# EAGLE design WalkerStalkerv21 (EAGLE 6.4)
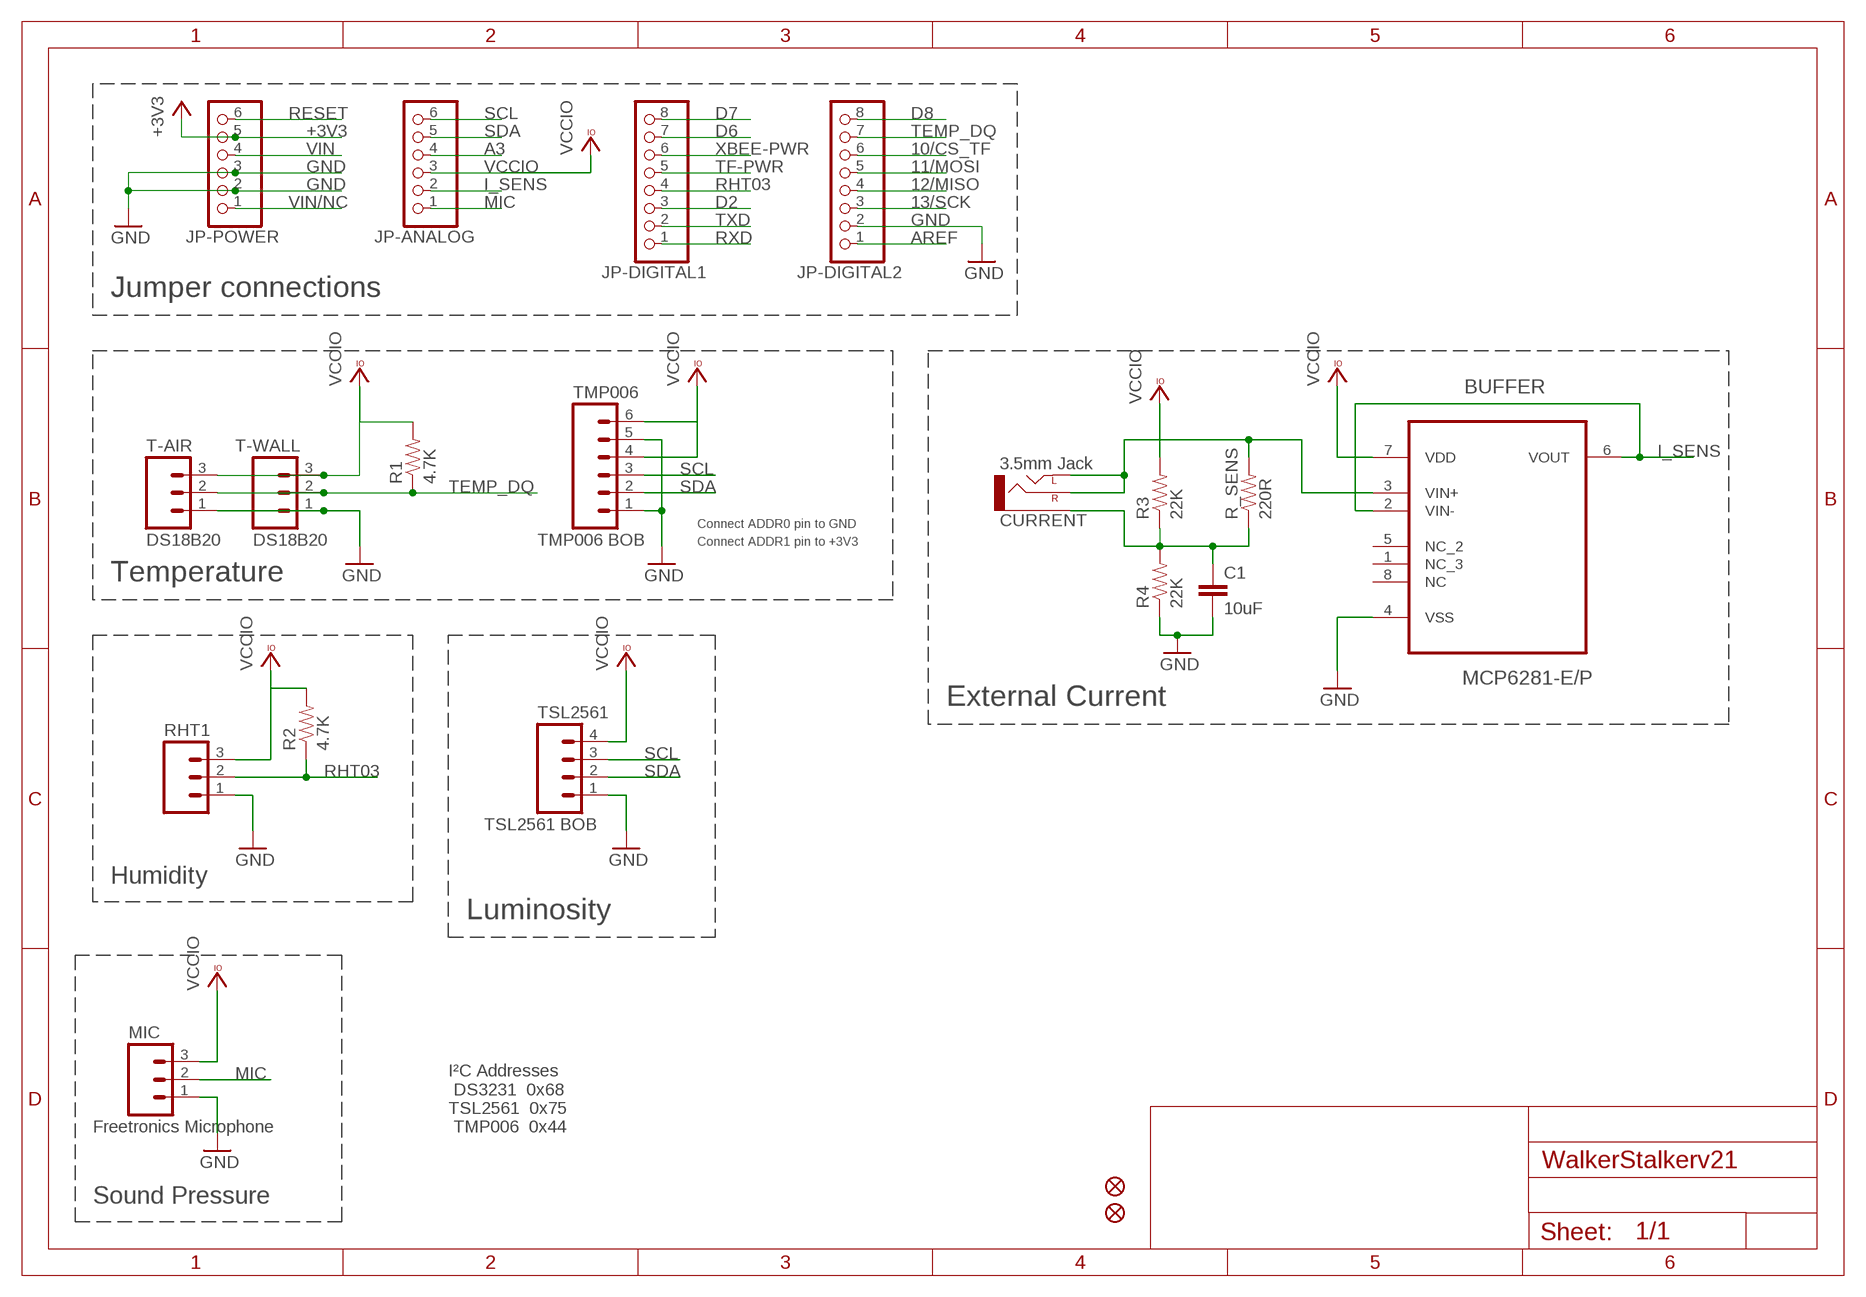
[diagram p0: schematic, sheet 1, part 1 of 2]
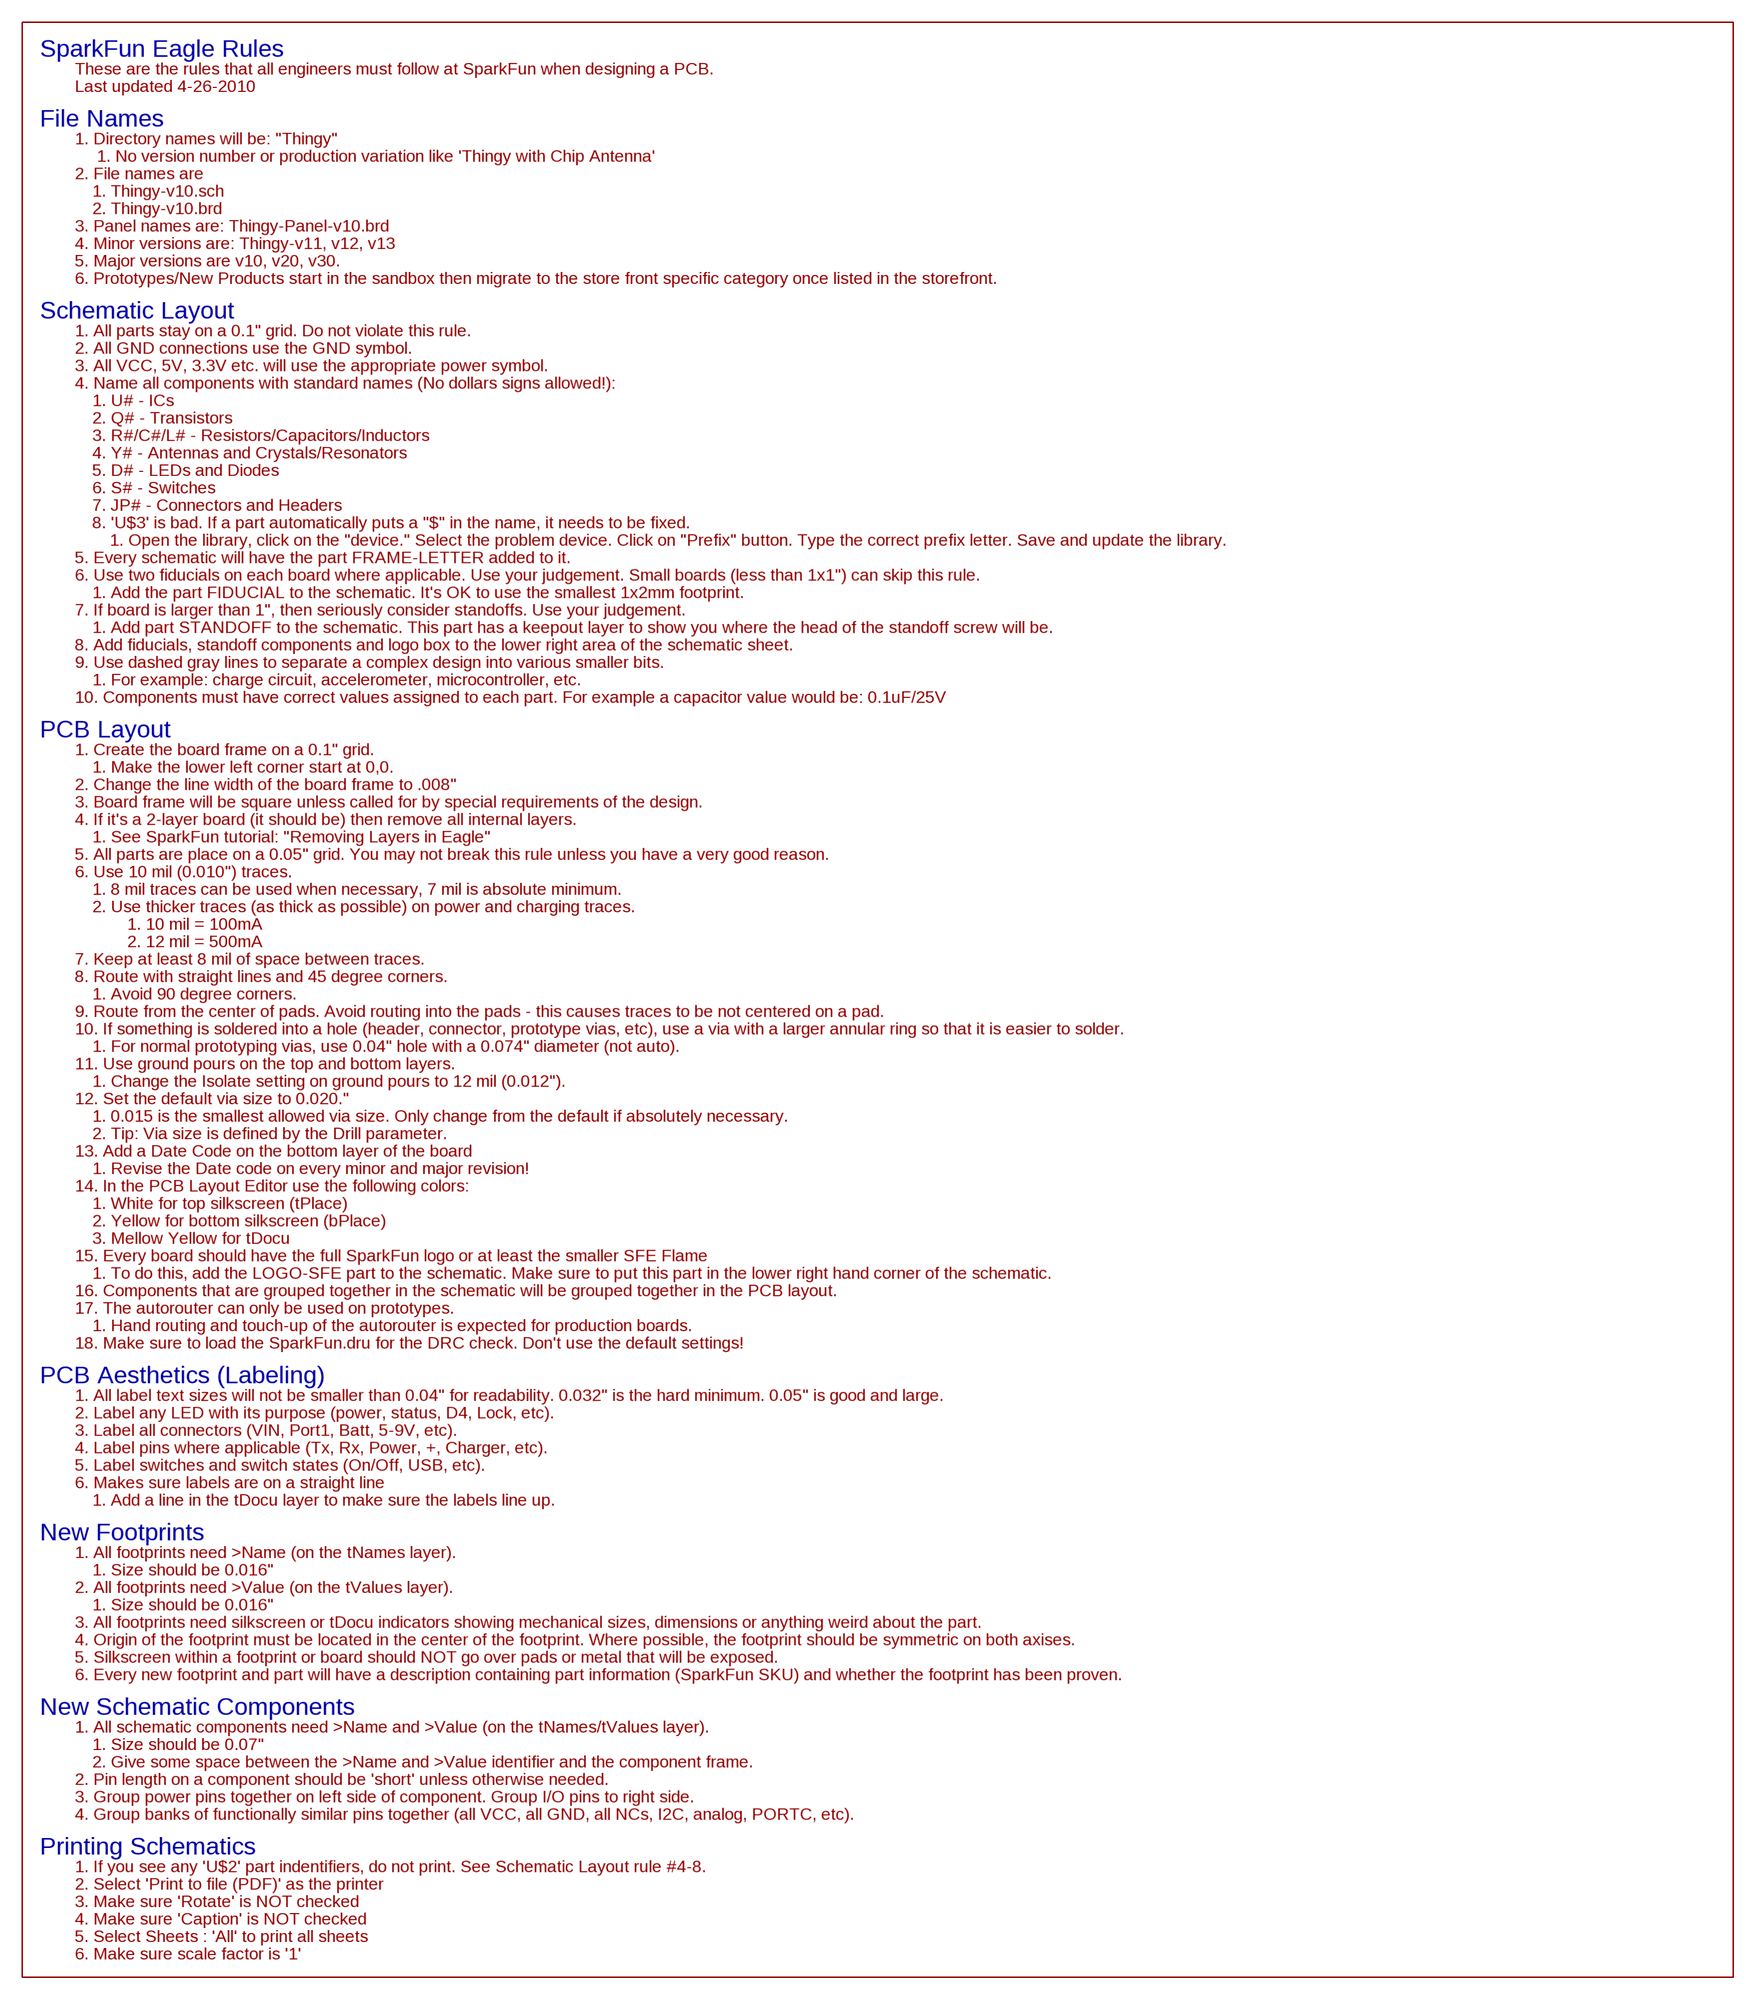
[diagram p1: schematic, sheet 1, part 2 of 2]

## Parts
BUFFER  MCP6281-E/P  [DIP254P762X432-8]
C1  10uF  CAP1206  [1206]
CURRENT  3.5mm Jack  AUDIO-JACKPTH  [AUDIO-JACK]
FID1  FIDUCIAL1.5X3  [FIDUCIAL-1.5X3]
FID2  FIDUCIAL1.5X3  [FIDUCIAL-1.5X3]
JP-ANALOG  PINHD-1X6CB  [1X06-CLEANBIG]
JP-DIGITAL1  PINHD-1X8CLEANBIG  [1X08-CLEANBIG]
JP-DIGITAL2  PINHD-1X8CLEANBIG  [1X08-CLEANBIG]
JP-POWER  PINHD-1X6CB  [1X06-CLEANBIG]
MIC  Freetronics Microphone  M03PTH  [1X03]
R1  4.7K  RESISTOR1206  [1206]
R2  4.7K  RESISTOR1206  [1206]
R3  22K  RESISTOR1206  [1206]
R4  22K  RESISTOR1206  [1206]
R_SENS  220R  RESISTOR1206  [1206]
RHT1  RHT03  M03PTH  [1X03]
T-AIR  DS18B20  M03PTH  [1X03]
T-WALL  DS18B20  M03PTH  [1X03]
TMP006  TMP006 BOB  M06SIP  [1X06]
TSL2561  TSL2561 BOB  M04PTH  [1X04]

## Nets
10/CS_TF: JP-DIGITAL2.6
11/MOSI: JP-DIGITAL2.5
12/MISO: JP-DIGITAL2.4
13/SCK: JP-DIGITAL2.3
+3V3: JP-POWER.5
A3: JP-ANALOG.4
AREF: JP-DIGITAL2.1
D2: JP-DIGITAL1.3
D6: JP-DIGITAL1.7
D7: JP-DIGITAL1.8
D8: JP-DIGITAL2.8
GND: BUFFER.4(VSS) C1.2 JP-DIGITAL2.2 JP-POWER.2 JP-POWER.3 MIC.1 R4.1 RHT1.1 T-AIR.1 T-WALL.1 TMP006.1 TMP006.5 TSL2561.1
I_SENS: BUFFER.2(VIN-) BUFFER.6(VOUT) JP-ANALOG.2
MIC: JP-ANALOG.1 MIC.2
N$1: BUFFER.3(VIN+) CURRENT.RING(RIGHT) CURRENT.TIP(LEFT) R_SENS.2
N$2: C1.1 CURRENT.SLEEVE R3.1 R4.2 R_SENS.1
RESET: JP-POWER.6
RHT03: JP-DIGITAL1.4 R2.1 RHT1.2
RXD: JP-DIGITAL1.1
SCL: JP-ANALOG.6 TMP006.3 TSL2561.3
SDA: JP-ANALOG.5 TMP006.2 TSL2561.2
TEMP_DQ: JP-DIGITAL2.7 R1.1 T-AIR.2 T-WALL.2
TF-PWR: JP-DIGITAL1.5
TXD: JP-DIGITAL1.2
VCCIO: BUFFER.7(VDD) JP-ANALOG.3 MIC.3 R1.2 R2.2 R3.2 RHT1.3 T-AIR.3 T-WALL.3 TMP006.4 TMP006.6 TSL2561.4
VIN: JP-POWER.4
VIN/NC: JP-POWER.1
XBEE-PWR: JP-DIGITAL1.6
Unconnected: BUFFER.1(NC_3) BUFFER.5(NC_2) BUFFER.8(NC)

## Notes on the sheet
- Jumper connections
- Connect ADDR0 pin to GND
- Connect ADDR1 pin to +3V3
- Temperature
- External Current
- Humidity
- Luminosity
- I²C Addresses 
   DS3231  0x68
  TSL2561  0x75
   TMP006  0x44
- Sound Pressure

## Library data of the parts
BUFFER = Microchip_By_element14_Batch_1:MCP6281-E/P: Rail-to-Rail Op Amp; DESCRIPTION: OP AMP; MPN: MCP6281-E/P; OC_FARNELL: 1439456; OC_NEWARK: -; PACKAGE: DIP-8; SUPPLIER: Microchip
C1 = SparkFun-Capacitors:CAP: Capacitor Standard 0603 ceramic capacitor, and 0.1" leaded capacitor.
CURRENT = SparkFun-Connectors:AUDIO-JACK: 3.5mm Audio Jack Simple 3.5mm common PCB mount audio jack. SKU: PRT-08032
FID1 FID2 = SparkFun-Aesthetics:FIDUCIAL: Fiducial Alignment Points Various fiducial points for machine vision alignment.
JP-ANALOG JP-POWER = carduino:PINHD-1X6: PIN HEADER
JP-DIGITAL1 JP-DIGITAL2 = carduino:PINHD-1X8: PIN HEADER
MIC RHT1 T-AIR T-WALL = SparkFun-Connectors:M03: Header 3 Standard 3-pin 0.1" header. Use with straight break away headers (SKU : PRT-00116), right angle break away headers (PRT-00553), swiss pins (PRT-00743), machine pins (PRT-00117), and female headers (PRT-00115). Molex polarized connector foot print use with SKU : PRT-08232 with associated crimp pins and housings.
R1-R4 R_SENS = SparkFun-Resistors:RESISTOR: Resistor Basic schematic elements and footprints for 0603, 1206, and PTH resistors.
TMP006 = SparkFun-Connectors:M06: Header 6 Standard 6-pin 0.1" header. Use with straight break away headers (SKU : PRT-00116), right angle break away headers (PRT-00553), swiss pins (PRT-00743), machine pins (PRT-00117), and female headers (PRT-00115). Molex polarized connector foot print use with SKU : PRT-08094 with associated crimp pins and housings. NOTES ON THE VARIANTS LOCK and LOCK_LONGPADS... This footprint was designed to help hold the alignment of a through-hole component (i.e. 6-pin header) while soldering it into place. You may notice that each hole has been shifted either up or down by 0.005 of an inch from it's more standard position (which is a perfectly straight line). This slight alteration caused the pins (the squares in the middle) to touch the edges of the holes. Because they are alternating, it causes a "brace" to hold the component in place. 0.005 has proven to be the perfect amount of "off-center" position when using our standard breakaway headers. Although looks a little odd when you look at the bare footprint, once you have a header in there, the alteration is very hard to notice. Also, if you push a header all the way into place, it is covered up entirely on the bottom side. This idea of altering the position of holes to aid alignment will be further integrated into the Sparkfun Library for other footprints. It can help hold any component with 3 or more connection pins.
TSL2561 = SparkFun-Connectors:M04: Header 4 Standard 4-pin 0.1" header. Use with straight break away headers (SKU : PRT-00116), right angle break away headers (PRT-00553), swiss pins (PRT-00743), machine pins (PRT-00117), and female headers (PRT-00115). Molex polarized connector foot print use with SKU : PRT-08231 with associated crimp pins and housings. 1MM SMD Version SKU: PRT-10208

## Board
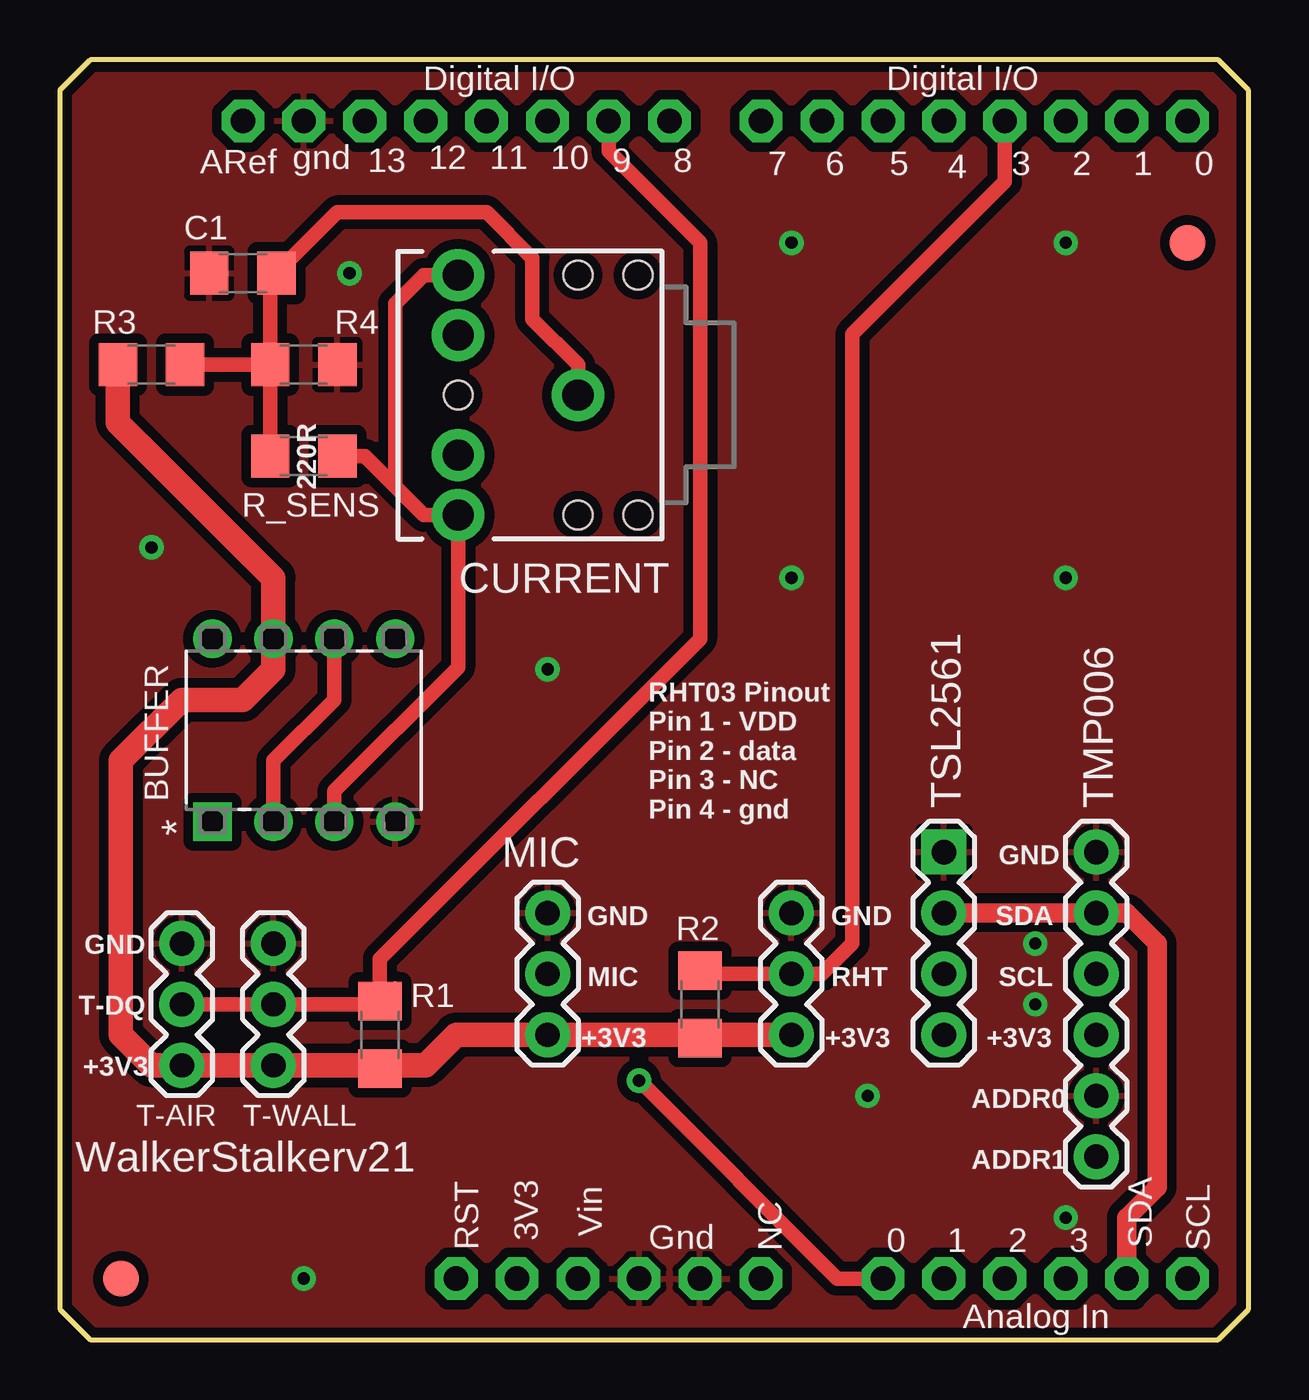
[diagram p2: board, top side]
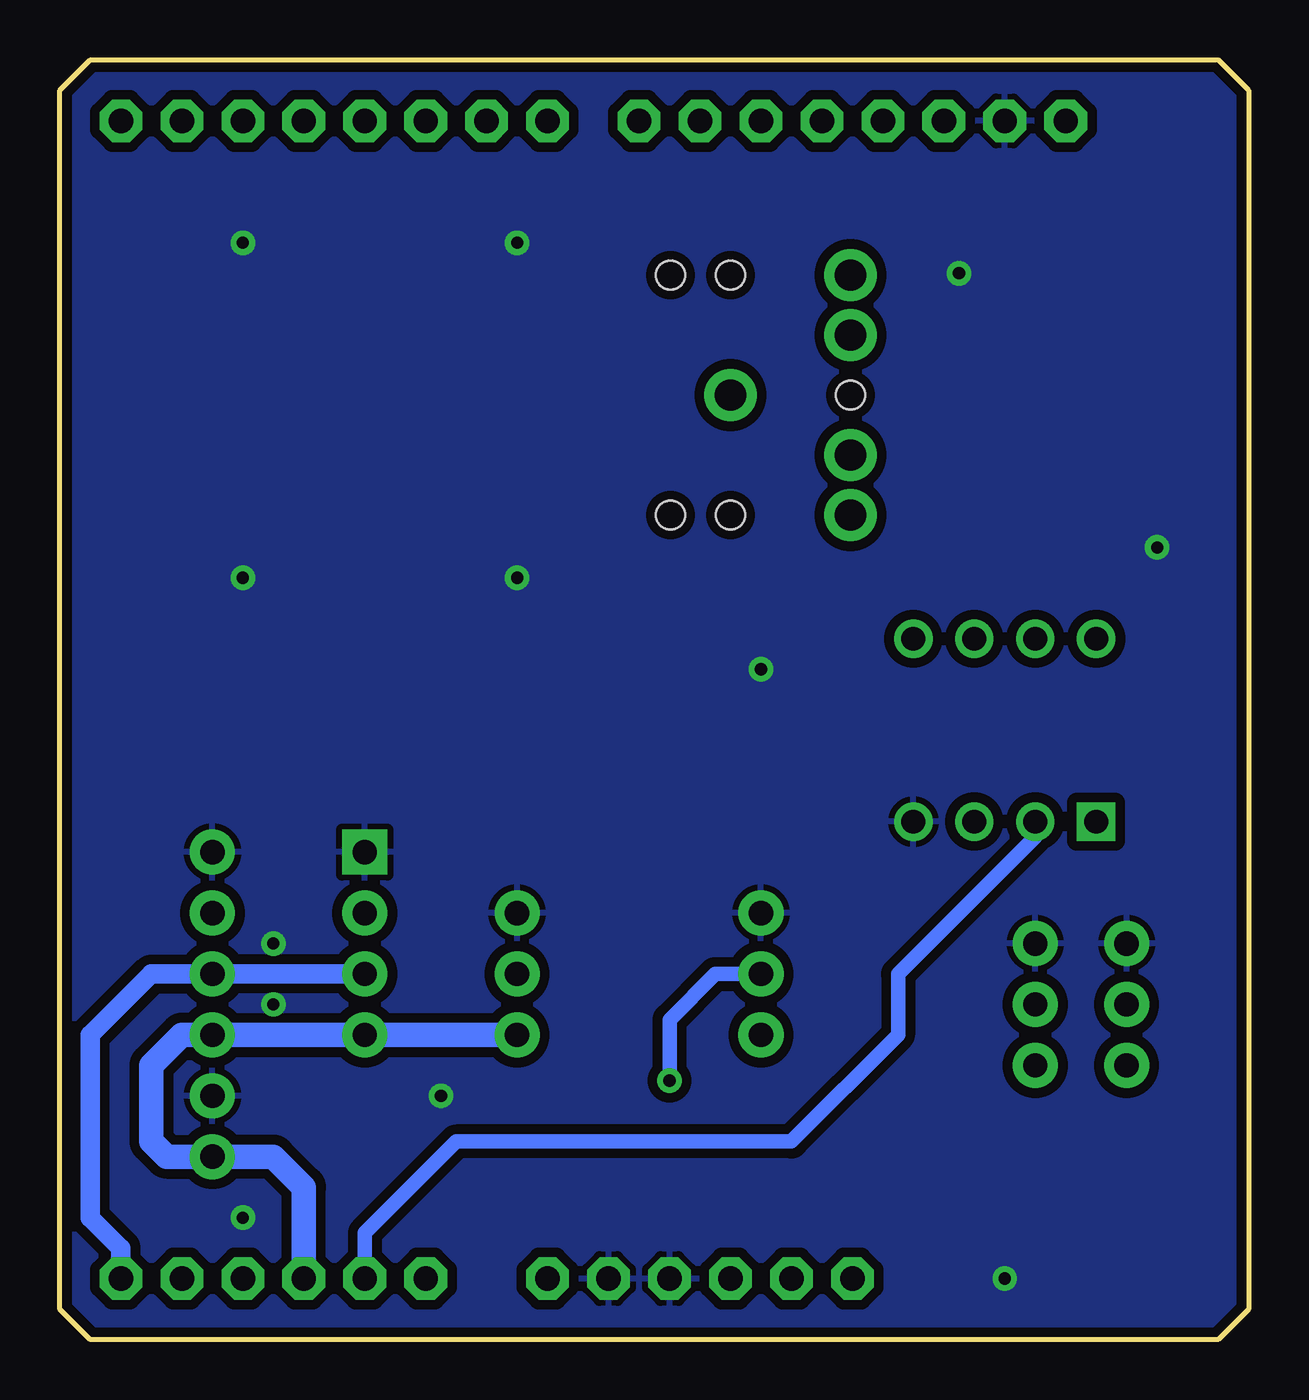
[diagram p3: board, bottom side, seen from below]

Size 49.53 x 53.34 mm. Coordinates in mm from the lower left corner, seen from the top.
Outline: 1.27,0 48.26,0 49.53,1.27 49.53,52.07 48.26,53.34 1.27,53.34 0,52.07 0,1.27 1.27,0
Copper layers (1*16): Top 0.035mm / dielectric 1.5mm / Bottom 0.035mm
Design rules "SparkFun": minimum track width 8mil, minimum drill 20mil, track to track 8mil, track to pad 8mil, pad to pad 8mil, via to via 8mil, smd to smd 8mil, copper to edge 10mil, drill to drill 8mil, minimum pad ring 12mil, minimum via ring 10mil, stop-mask expansion 4mil, vias tented up to drill 25mil, thermal gap 10mil

### Footprints (pad centres in the part's own frame; a part is rotated, then mirrored left to right if it is on the bottom)
DIP254P762X432-8 = drill 0.991 square: 1 -7.62,7.62 | drill 0.991: 2 -7.62,5.08; 3 -7.62,2.54; 4 -7.62,0; 5 0,0; 6 0,2.54; 7 0,5.08; 8 0,7.62
1206 = smd 1.6 x 1.8: 1 -1.4,0; 2 1.4,0
AUDIO-JACK = drill 1.3 pad 2.184: RING 5,5; RSH 5,2.5; SLEEVE 0,0; TIP 5,-5; TSH 5,-2.5 | hole 1.2: 0,5; -2.5,5; -2.5,-5; 0,-5; 5,0
FIDUCIAL-1.5X3 = smd 1.5 x 1.5: 1 0,0
1X06-CLEANBIG = drill 1.016 pad 1.778 octagon: 1 -6.35,0; 2 -3.81,0; 3 -1.27,0; 4 1.27,0; 5 3.81,0; 6 6.35,0
1X08-CLEANBIG = drill 1.016 pad 1.778 octagon: 1 -8.89,0; 2 -6.35,0; 3 -3.81,0; 4 -1.27,0; 5 1.27,0; 6 3.81,0; 7 6.35,0; 8 8.89,0
1X03 = drill 1.016 pad 1.88: 1 0,0; 2 2.54,0; 3 5.08,0
1X06 = drill 1.016 pad 1.88: 1 0,0; 2 2.54,0; 3 5.08,0; 4 7.62,0; 5 10.16,0; 6 12.7,0
1X04 = drill 1.016 pad 1.88 square: 1 0,0 | drill 1.016 pad 1.88: 2 2.54,0; 3 5.08,0; 4 7.62,0

### Placement (x,y rotation side)
BUFFER  13.97,29.21 90 top
C1  7.62,44.45 180 top
CURRENT  21.59,39.37 180 top
FID1  46.99,45.72 0 top
FID2  2.54,2.54 0 top
JP-ANALOG  40.64,2.54 0 top
JP-DIGITAL1  38.1,50.8 180 top
JP-DIGITAL2  16.51,50.8 0 top
JP-POWER  22.86,2.54 180 top
MIC  20.32,17.78 270 top
R1  13.33,12.7 270 top
R2  26.67,13.97 270 top
R3  3.81,40.64 180 top
R4  10.16,40.64 180 top
R_SENS  10.16,36.83 0 top
RHT1  30.48,17.78 270 top
T-AIR  5.08,16.51 270 top
T-WALL  8.89,16.51 270 top
TMP006  43.18,20.32 270 top
TSL2561  36.83,20.32 270 top

### Tracks (layer width: path | path; a pad name or v marks a point on that pad's centre or on a via)
GND  (via drill 0.51)
  other vias: 40.64,13.97 40.64,16.51 3.81,33.02 20.32,27.94 30.48,31.75 30.48,45.72 41.91,45.72 41.91,31.75 33.66,10.16 10.16,2.54 12.06,44.45 41.91,5.08
  pour Top (isolate 0.406): 1.27,53.34 48.26,53.34 49.53,52.07 49.53,1.27 48.26,0 1.27,0 0,1.27 0,52.07
  pour Bottom (isolate 0.406): 0,52.07 1.27,53.34 48.26,53.34 49.53,52.07 49.53,1.27 48.26,0 1.27,0 0,1.27
I_SENS
  Top 0.61: BUFFER.6 11.43,26.67 8.89,24.13 BUFFER.2
  Bottom 0.406: BUFFER.2 8.89,20.95
  Bottom 0.61: 8.89,20.95 14.61,15.24 14.61,12.7 19.05,8.26 33.02,8.26 36.83,4.45 JP-ANALOG.2
MIC  (via drill 0.51)
  Top 0.61: JP-ANALOG.1 32.38,2.54 v24.13,10.79
  Bottom 0.61: v24.13,10.79 24.13,13.34 22.23,15.24 MIC.2
N$1
  Top 0.61: BUFFER.3 11.43,22.86 16.59,28.02 CURRENT.RING 15.16,34.37 13.97,35.56 | CURRENT.TIP 15.16,44.37 13.97,43.18 13.97,35.56 | R_SENS.2 12.7,36.83 13.97,35.56
N$2
  Top 0.61: R4.2 R_SENS.1 | CURRENT.SLEEVE 21.59,40.64 19.68,42.55 19.68,45.09 17.78,46.99 11.56,46.99 C1.1 8.76,44.19 R4.2 | R3.1 R4.2
RHT03
  Top 0.406: 26.8,15.24 R2.1
  Top 0.61: JP-DIGITAL1.4 39.37,48.26 33.02,41.91 33.02,24.13 33.02,23.5 33.02,16.51 31.75,15.24 RHT1.2 26.8,15.24
SCL
  Bottom 0.813: TSL2561.3 TMP006.3 45.72,15.24 48.26,12.7 48.26,5.08 46.99,3.81 JP-ANALOG.6
SDA
  Top 0.813: TSL2561.2 TMP006.2 44.45,17.78 45.72,16.51 45.72,6.35 44.45,5.08 JP-ANALOG.5
TEMP_DQ
  Top 0.406: 13.97,14.73 R1.1 13.21,13.97
  Top 0.61: T-AIR.2 T-WALL.2 13.21,13.97 | JP-DIGITAL2.7 22.86,49.53 26.67,45.72 26.67,29.21 13.34,15.88 R1.1 | R1.1
VCCIO
  Top 0.813: 26.67,12.7 R2.2 26.8,12.7 | 13.47,11.43 R1.2 13.2,11.43
  Top 1.016: 13.2,11.43 T-WALL.3 T-AIR.3 3.81,11.43 2.54,12.7 2.54,24.13 5.08,26.67 7.62,26.67 8.89,27.94 BUFFER.7 8.89,31.75 2.41,38.23 R3.2 | RHT1.3 26.8,12.7 | 13.47,11.43 15.24,11.43 16.51,12.7 MIC.3 26.54,12.7 R2.2
  Bottom 1.016: RHT1.3 TSL2561.4 TMP006.4 44.45,12.7 45.72,11.43 45.72,8.26 45.09,7.62 TMP006.6 40.64,7.62 39.37,6.35 JP-ANALOG.3

### Text on the board
tPlace: Digital I/O | Digital I/O | ARef | gnd | 13 | 12 | 11 | 10 | 9 | 8 | 7 | 6 | 5 | 3 | 2 | 1 | 0 | 4 | 220R | RHT03 Pinout / Pin 1 - VDD / Pin 2 - data / Pin 3 - NC / Pin 4 - gnd | GND | GND | GND | GND | SDA | MIC | RHT | SCL | T-DQ | +3V3 | +3V3 | +3V3 | +3V3 | ADDR0 | RST | 3V3 | ADDR1 | Vin | NC | Gnd | 0 | 1 | 2 | 3 | SDA | SCL | Analog In